# Altium schematic sheet Kar_PCB.SchDoc
size 241 x 190 mm; SheetNumber: 1; SheetTotal: 6; ENG_APP_DATE: --/--/--; DSN_APP_DATE: --/--/--; CHK_APP_DATE: --/--/--
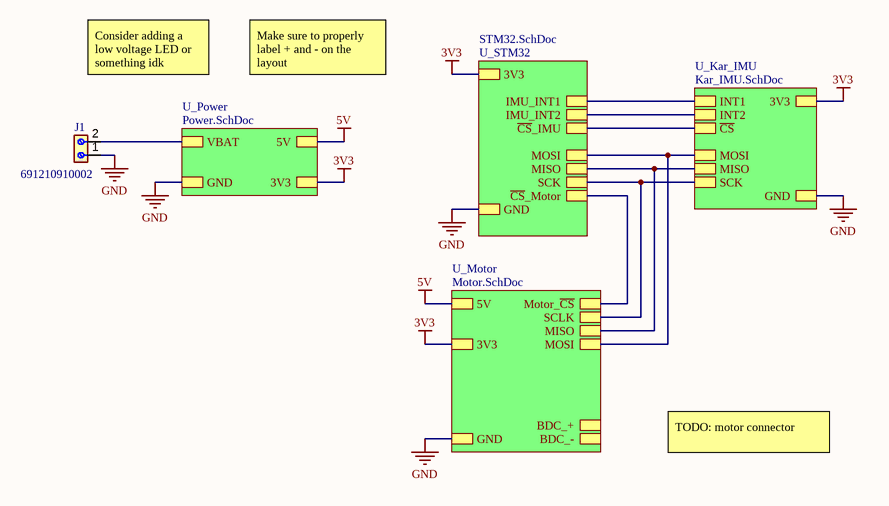
[diagram p0: Kar_PCB.SchDoc]

## Parts
J1  691210910002  [691210910002]

## Sub-sheets
U_Kar_IMU = Kar_IMU.SchDoc: 3V3, GND, ~{CS}, SCK, MISO, MOSI, INT1, INT2
U_Motor = Motor.SchDoc: 5V, GND, BDC_+, BDC_-, MOSI, Motor_~{CS}, SCLK, 3V3, MISO
U_Power = Power.SchDoc: VBAT, GND, 5V, 3V3
U_STM32 = STM32.SchDoc: MOSI, MISO, SCK, 3V3, GND, ~{CS}_Motor, ~{CS}_IMU, IMU_INT2, IMU_INT1

## Nets
3V3: sheet U_Motor/3V3, sheet U_Power/3V3, sheet U_STM32/3V3, sheet U_Kar_IMU/3V3
5V: sheet U_Motor/5V, sheet U_Power/5V
GND: J1.1 ; sheet U_Motor/GND, sheet U_Power/GND, sheet U_STM32/GND, sheet U_Kar_IMU/GND
NetJ1_2: J1.2 ; sheet U_Power/VBAT
(unnamed): sheet U_Motor/MOSI, sheet U_STM32/MOSI, sheet U_Kar_IMU/MOSI
(unnamed): sheet U_Motor/Motor_~{CS}, sheet U_STM32/~{CS}_Motor
(unnamed): sheet U_Motor/SCLK, sheet U_STM32/SCK, sheet U_Kar_IMU/SCK
(unnamed): sheet U_Motor/MISO, sheet U_STM32/MISO, sheet U_Kar_IMU/MISO
(unnamed): sheet U_STM32/~{CS}_IMU, sheet U_Kar_IMU/~{CS}
(unnamed): sheet U_STM32/IMU_INT2, sheet U_Kar_IMU/INT2
(unnamed): sheet U_STM32/IMU_INT1, sheet U_Kar_IMU/INT1

## Notes on the sheet
- Consider adding a low voltage LED or something idk
- Make sure to properly label + and - on the layout
- TODO: motor connector
- DWG. NO.
- REV.
- SHT.
- THIS DOCUMENT AND THE DATA DISCLOSED HEREIN OR HEREWITH IS THE PROPERTY OF ALTIUM LIMITED AND MAY BE FREELY DISTRIBUTED IN WHOLE. NO RIGHTS ARE RESERVED OR EXPRESS OR IMPLIED WARANTEE GIVEN.
- REVISION
- DESCRIPTION
- DATE
- APPROVED
- ENG:
- APPROVALS
- PROJECT
- DSN:
- CHK:
- REFERENCE DOCUMENTS
- PROJECT REVISION:
- TITLE
- DOCUMENT REVISION:
- DESIGN ITEM:
- BOM:
- FAB DWG:
- PCB DWG:
- ASSY DWG:
- SCALE:
- SIZE
- B
- CAGE CODE
- FILE NAME
- DWG NO.
- SHEET
- OF
- REV

## Library data of the parts
J1 = 691210910002: MF: {'manufacturer': u'W\xfcrth Elektronik'}; Package: None; Price: None; Value: *; MP: 691210910002; Availability: Unavailable